# EAGLE design goodfet42 (EAGLE 6.5.0)
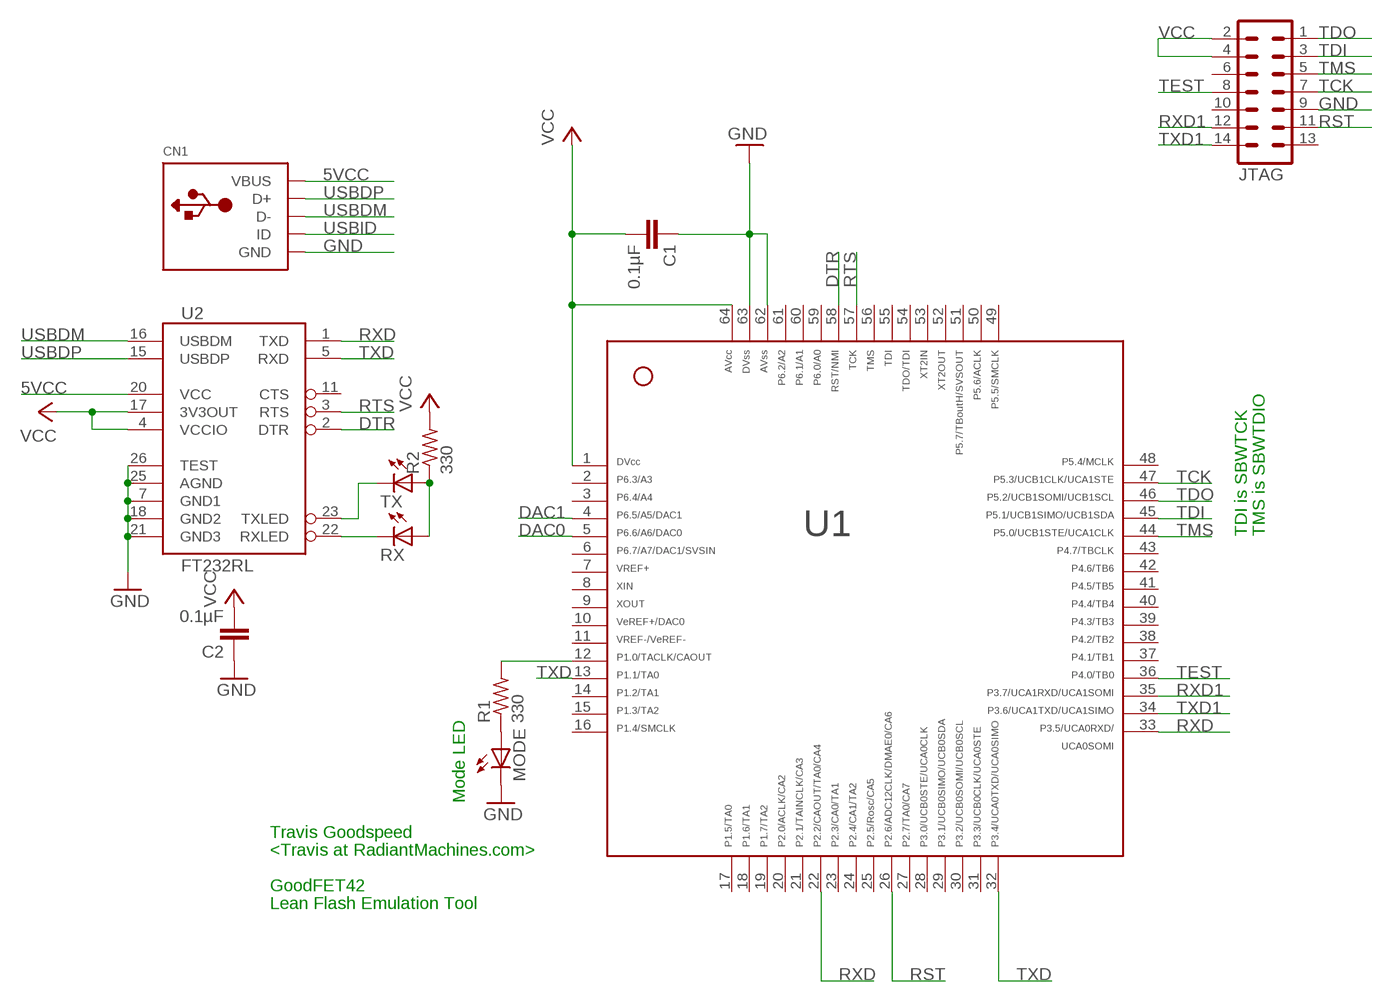
[diagram p0: schematic, sheet 1]

## Parts
C1  0.1µF  C-EUC0603  [C0603]
C2  0.1µF  C-EUC0603  [C0603]
CN1  USBMINIB  [USB-MINIB]
JTAG  MA07-2  [MA07-2]
MODE  LEDCHIP-LED0603  [CHIP-LED0603]
R1  330  R-US_R0603  [R0603]
R2  330  R-US_R0603  [R0603]
RX  LEDCHIP-LED0603  [CHIP-LED0603]
TX  LEDCHIP-LED0603  [CHIP-LED0603]
U1  MSP430F2618TPM  F261X---PM64  [PM/PAG64]
U2  FT232RL  FT232RL-BASICSSOP  [SSOP28DB]

## Nets
5VCC: CN1.VBUS U2.20(VCC)
DAC0: U1.5
DAC1: U1.4
DTR: U1.58 U2.2(DTR)
GND: C1.1 C2.1 CN1.GND JTAG.9 MODE.C U1.62 U1.63 U2.7(GND1) U2.18(GND2) U2.21(GND3) U2.25(AGND) U2.26(TEST)
N$1: R1.2 U1.12
N$2: MODE.A R1.1
N$6: RX.C U2.22(RXLED)
N$7: TX.C U2.23(TXLED)
N$8: R2.1 RX.A TX.A
RST: JTAG.11 U1.26
RTS: U1.57 U2.3(RTS)
RXD: U1.22 U1.33 U2.1(TXD)
RXD1: JTAG.12 U1.35
TCK: JTAG.7 U1.47
TDI: JTAG.3 U1.45
TDO: JTAG.1 U1.46
TEST: JTAG.8 U1.36
TMS: JTAG.5 U1.44
TXD: U1.13 U1.32 U2.5(RXD)
TXD1: JTAG.14 U1.34
USBDM: CN1.D- U2.16(USBDM)
USBDP: CN1.D+ U2.15(USBDP)
USBID: CN1.ID
VCC: C1.2 C2.2 JTAG.2 JTAG.4 R2.2 U1.1 U1.64 U2.4(VCCIO) U2.17(3V3OUT)
Unconnected: JTAG.6 JTAG.10 JTAG.13 U1.2 U1.3 U1.6 U1.7 U1.8 U1.9 U1.10 U1.11 U1.14 U1.15 U1.16 U1.17 U1.18 U1.19 U1.20 U1.21 U1.23 U1.24 U1.25 U1.27 U1.28 U1.29 U1.30 U1.31 U1.37 U1.38 U1.39 U1.40 U1.41 U1.42 U1.43 U1.48 U1.49 U1.50 U1.51 U1.52 U1.53 U1.54 U1.55 U1.56 U1.59 U1.60 U1.61 U2.11(CTS)

## Notes on the sheet
- TDI is SBWTCK | TMS is SBWTDIO
- Mode LED
- Travis Goodspeed
- <Travis at RadiantMachines.com>
- GoodFET42
- Lean Flash Emulation Tool

## Library data of the parts
C1 C2 = rcl:C-EU: CAPACITOR, European symbol
CN1 = adafruit:USB: USB Connectors USBMINIB - Surface Mount Female Mini-B USB Connector 4UConnector: 06564 By microbuilder.eu Thru-hole RA Female Mini-B USB Connector 4UConnector: 18732 By ladyada.net
JTAG = con-lstb:MA07-2: PIN HEADER
MODE RX TX = led:LED: LED OSRAM: - CHIPLED LG R971, LG N971, LY N971, LG Q971, LY Q971, LO R971, LY R971 LH N974, LH R974 LS Q976, LO Q976, LY Q976 LO Q996 - Hyper CHIPLED LW Q18S LB Q993, LB Q99A, LB R99A - SideLED LS A670, LO A670, LY A670, LG A670, LP A670 LB A673, LV A673, LT A673, LW A673 LH A674 LY A675 LS A676, LA A676, LO A676, LY A676, LW A676 LS A679, LY A679, LG A679 - Hyper Micro SIDELED® LS Y876, LA Y876, LO Y876, LY Y876 LT Y87S - SmartLED LW L88C, LW L88S LB L89C, LB L89S, LG L890 LS L89K, LO L89K, LY L89K LS L896, LA L896, LO L896, LY L896 - TOPLED LS T670, LO T670, LY T670, LG T670, LP T670 LSG T670, LSP T670, LSY T670, LOP T670, LYG T670 LG T671, LOG T671, LSG T671 LB T673, LV T673, LT T673, LW T673 LH T674 LS T676, LA T676, LO T676, LY T676, LB T676, LH T676, LSB T676, LW T676 LB T67C, LV T67C, LT T67C, LS T67K, LO T67K, LY T67K, LW E67C LS E67B, LA E67B, LO E67B, LY E67B, LB E67C, LV E67C, LT E67C LW T67C LS T679, LY T679, LG T679 LS T770, LO T770, LY T770, LG T770, LP T770 LB T773, LV T773, LT T773, LW T773 LH T774 LS E675, LA E675, LY E675, LS T675 LS T776, LA T776, LO T776, LY T776, LB T776 LHGB T686 LT T68C, LB T68C - Hyper Mini TOPLED® LB M676 - Mini TOPLED Santana® LG M470 LS M47K, LO M47K, LY M47K Source: http://www.osram.convergy.de LUXEON: - LUMILED® LXK2-PW12-R00, LXK2-PW12-S00, LXK2-PW14-U00, LXK2-PW14-V00 LXK2-PM12-R00, LXK2-PM12-S00, LXK2-PM14-U00 LXK2-PE12-Q00, LXK2-PE12-R00, LXK2-PE12-S00, LXK2-PE14-T00, LXK2-PE14-U00 LXK2-PB12-K00, LXK2-PB12-L00, LXK2-PB12-M00, LXK2-PB14-N00, LXK2-PB14-P00, LXK2-PB14-Q00 LXK2-PR12-L00, LXK2-PR12-M00, LXK2-PR14-Q00, LXK2-PR14-R00 LXK2-PD12-Q00, LXK2-PD12-R00, LXK2-PD12-S00 LXK2-PH12-R00, LXK2-PH12-S00 LXK2-PL12-P00, LXK2-PL12-Q00, LXK2-PL12-R00 Source: www.luxeon.com KINGBRIGHT: KA-3528ASYC Source: www.kingbright.com
R1 R2 = rcl:R-US_: RESISTOR, American symbol
U1 = TI_MSP430_v13:F261X---PM64: ***MSP430F261x***PM64
U2 = SparkFun:FT232RL-BASIC: USB UART This is the simplified version of the FT232RL unit. Only what you need, nothing you don't. Spark Fun Electronics SKU : COM-00650

## Board
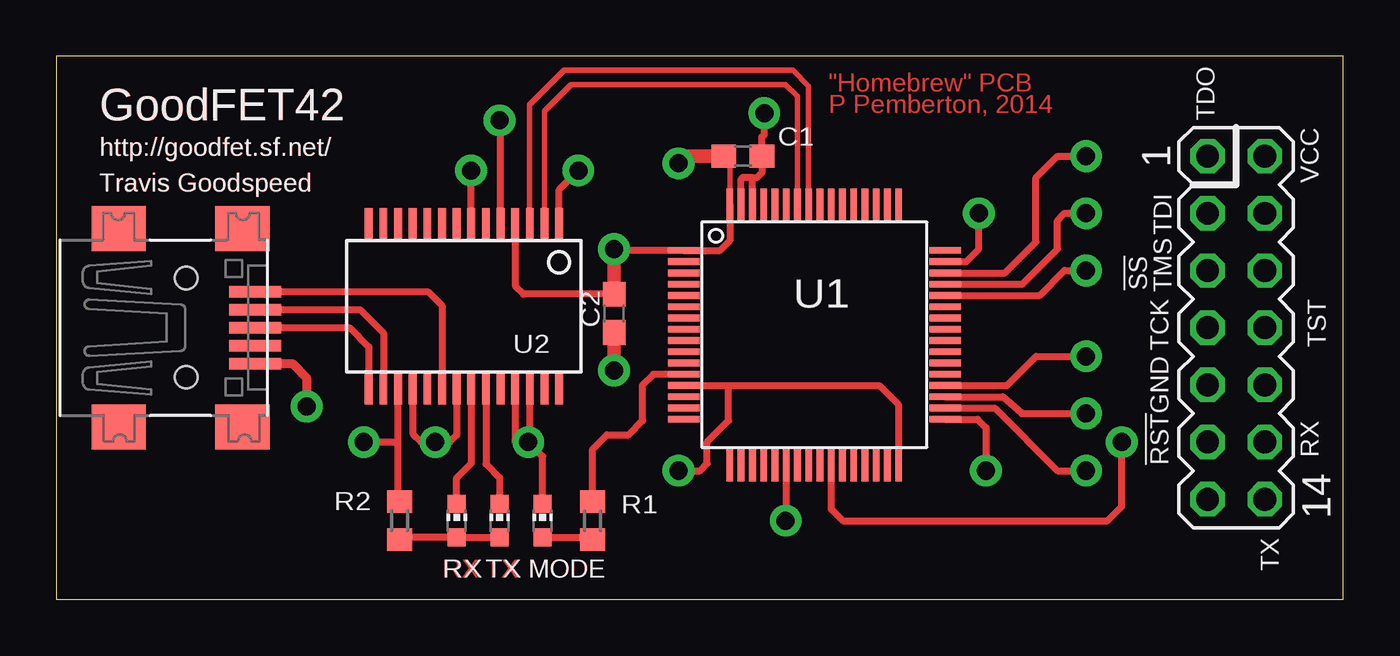
[diagram p1: board, top side]
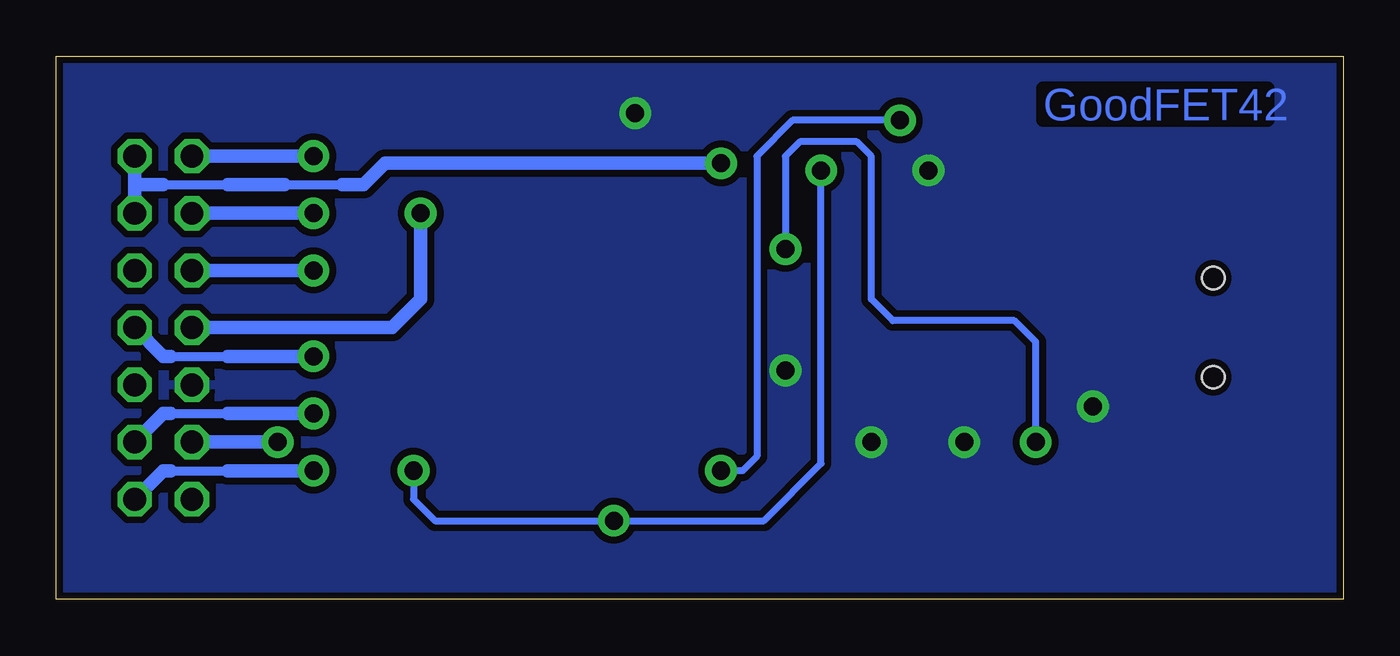
[diagram p2: board, bottom side, seen from below]

Size 57.14 x 24.12 mm. Coordinates in mm from the lower left corner, seen from the top.
Outline: 0,0 57.14,0 57.14,24.12 0,24.12 0,0
Copper layers (1*16): Top 0.035mm / dielectric 1.5mm / Bottom 0.035mm
Design rules "default *": minimum track width 10mil, minimum drill 8mil, track to track 6mil, track to pad 6mil, pad to pad 6mil, via to via 6mil, smd to smd 6mil, copper to edge 10mil, drill to drill 8mil, minimum pad ring 10mil, minimum via ring 12mil, stop-mask expansion 4mil, vias tented up to drill 25mil, thermal gap 10mil

### Footprints (pad centres in the part's own frame; a part is rotated, then mirrored left to right if it is on the bottom)
C0603 = smd 1.1 x 1: 1 -0.85,0; 2 0.85,0
USB-MINIB = smd 0.5 x 2.308: D+ 0,4.064; D- -0.8,4.064; GND 1.6,4.064; ID 0.8,4.064; VBUS -1.6,4.064 | smd 2 x 2.4: GND1 -4.4,-2; GND2 -4.4,3.5; GND3 4.4,3.5; GND4 4.4,-2 | hole 1: -2.2,1; 2.2,1
MA07-2 = drill 1.016 octagon: 1 -7.62,-1.27; 2 -7.62,1.27; 3 -5.08,-1.27; 4 -5.08,1.27; 5 -2.54,-1.27; 6 -2.54,1.27; 7 0,-1.27; 8 0,1.27; 9 2.54,-1.27; 10 2.54,1.27; 11 5.08,-1.27; 12 5.08,1.27; 13 7.62,-1.27; 14 7.62,1.27
CHIP-LED0603 = smd 0.8 x 0.8: A 0,-0.75; C 0,0.75
R0603 = smd 1 x 1.1: 1 -0.85,0; 2 0.85,0
PM/PAG64 = smd 1.4 x 0.3: 1 -5.8,3.75; 2 -5.8,3.25; 3 -5.8,2.75; 4 -5.8,2.25; 5 -5.8,1.75; 6 -5.8,1.25; 7 -5.8,0.75; 8 -5.8,0.25; 9 -5.8,-0.25; 10 -5.8,-0.75; 11 -5.8,-1.25; 12 -5.8,-1.75; 13 -5.8,-2.25; 14 -5.8,-2.75; 15 -5.8,-3.25; 16 -5.8,-3.75; 33 5.8,-3.75; 34 5.8,-3.25; 35 5.8,-2.75; 36 5.8,-2.25; 37 5.8,-1.75; 38 5.8,-1.25; 39 5.8,-0.75; 40 5.8,-0.25; 41 5.8,0.25; 42 5.8,0.75; 43 5.8,1.25; 44 5.8,1.75; 45 5.8,2.25; 46 5.8,2.75; 47 5.8,3.25; 48 5.8,3.75 | smd 0.3 x 1.4: 17 -3.75,-5.8; 18 -3.25,-5.8; 19 -2.75,-5.8; 20 -2.25,-5.8; 21 -1.75,-5.8; 22 -1.25,-5.8; 23 -0.75,-5.8; 24 -0.25,-5.8; 25 0.25,-5.8; 26 0.75,-5.8; 27 1.25,-5.8; 28 1.75,-5.8; 29 2.25,-5.8; 30 2.75,-5.8; 31 3.25,-5.8; 32 3.75,-5.8; 49 3.75,5.8; 50 3.25,5.8; 51 2.75,5.8; 52 2.25,5.8; 53 1.75,5.8; 54 1.25,5.8; 55 0.75,5.8; 56 0.25,5.8; 57 -0.25,5.8; 58 -0.75,5.8; 59 -1.25,5.8; 60 -1.75,5.8; 61 -2.25,5.8; 62 -2.75,5.8; 63 -3.25,5.8; 64 -3.75,5.8
SSOP28DB = smd 0.348 x 1.397: 1 -4.225,-3.656; 2 -3.575,-3.656; 3 -2.925,-3.656; 4 -2.275,-3.656; 5 -1.625,-3.656; 6 -0.975,-3.656; 7 -0.325,-3.656; 8 0.325,-3.656; 9 0.975,-3.656; 10 1.625,-3.656; 11 2.275,-3.656; 12 2.925,-3.656; 13 3.575,-3.656; 14 4.225,-3.656; 15 4.225,3.656; 16 3.575,3.656; 17 2.925,3.656; 18 2.275,3.656; 19 1.625,3.656; 20 0.975,3.656; 21 0.325,3.656; 22 -0.325,3.656; 23 -0.975,3.656; 24 -1.625,3.656; 25 -2.275,3.656; 26 -2.925,3.656; 27 -3.575,3.656; 28 -4.225,3.656

### Placement (x,y rotation side)
C1  30.48,19.68 180 top
C2  24.77,12.7 90 top
CN1  4.76,12.06 270 top
JTAG  52.39,12.06 270 top
MODE  21.59,3.49 0 top
R1  23.81,3.49 90 top
R2  15.24,3.49 90 top
RX  17.78,3.49 0 top
TX  19.68,3.49 0 top
U1  33.66,11.75 0 top
U2  18.1,13.02 180 top

### Tracks (layer width: path | path; a pad name or v marks a point on that pad's centre or on a via)
5VCC
  Top 0.305: U2.20 17.12,13.04 16.5,13.66 CN1.VBUS
DTR
  Top 0.254: U2.2 21.67,21.67 22.86,22.86 32.38,22.86 32.91,22.34 U1.58
GND  (via drill 0.8)
  Top 0.254: 24.87,11.75 C2.1 | U2.7 18.42,16.52 18.41,16.51
  Top 0.305: U2.18 15.82,7.36 16.19,6.99 v16.83,6.99 17.46,6.99 17.77,7.29 U2.21 | 18.41,16.51 v18.41,19.05 | U1.63 30.41,18.66 30.48,18.73 30.91,18.73 | 30.91,18.73 31.11,18.73 31.33,18.95 C1.1 31.33,20.54 31.43,20.64 v31.43,21.59 | U1.62 30.91,18.73 | MODE.C 21.59,6.35 v20.95,6.99 | U2.25 20.37,6.99 v20.95,6.99 | U2.26 21.02,6.99 v20.95,6.99
  Top 0.406: CN1.GND 10.49,10.46 11.11,9.84 v11.11,8.57
  Top 0.61: v24.77,10.16 C2.1
  pour Bottom (isolate 0.305): 0.32,0.32 56.83,0.32 56.83,23.81 0.32,23.81
N$1
  Top 0.305: R1.2 23.81,6.67 24.45,7.3 25.4,7.3 26.04,7.94 26.04,9.53 26.51,10 U1.12
N$2
  Top 0.305: MODE.A 23.71,2.74 R1.1
N$6
  Top 0.305: RX.C 17.78,5.4 18.42,6.04 U2.22
N$7
  Top 0.305: U2.23 19.07,6.01 19.68,5.4 TX.C
N$8
  Top 0.305: R2.1 15.34,2.74 RX.A TX.A
RST  (via drill 0.8)
  Top 0.305: U1.26 34.41,4.01 34.92,3.49 46.67,3.49 47.31,4.13 v47.31,6.99
  Bottom 0.61: JTAG.11 v47.31,6.99
RTS
  Top 0.254: U2.3 21.02,21.98 22.54,23.5 32.7,23.5 33.41,22.79 U1.57
RXD  (via drill 0.8)
  Top 0.305: U1.22 32.41,3.51 v32.38,3.49 | U2.1 22.32,18.2 v23.18,19.05 | U1.33 40.9,8 41.27,7.62 v41.27,5.71
  Bottom 0.305: v23.18,19.05 23.18,6.03 25.72,3.49 v32.38,3.49 40.32,3.49 41.27,4.45 v41.27,5.71
RXD1  (via drill 0.8)
  Top 0.305: U1.35 42.02,9 42.86,8.26 v45.72,8.26
  Bottom 0.406: 52.07,8.26 49.53,8.26
  Bottom 0.61: JTAG.12 52.39,8.26 52.07,8.26 | 49.53,8.26 v45.72,8.26
TCK  (via drill 0.8)
  Top 0.305: U1.47 40.4,15 40.96,15.56 v40.96,17.14
  Bottom 0.61: JTAG.7 42.23,12.06 40.96,13.34 v40.96,17.14
TDI  (via drill 0.8)
  Top 0.305: U1.45 42.89,14 44.45,15.56 44.45,16.83 44.77,17.14 v45.72,17.14
  Bottom 0.61: JTAG.3 v45.72,17.14
TDO  (via drill 0.8)
  Top 0.305: U1.46 42.12,14.5 43.5,15.88 43.5,18.73 44.45,19.68 v45.72,19.68
  Bottom 0.61: JTAG.1 v45.72,19.68
TEST  (via drill 0.8)
  Top 0.305: U1.36 42.2,9.5 43.5,10.79 v45.72,10.79
  Bottom 0.406: 52.07,10.79 49.53,10.79
  Bottom 0.61: JTAG.8 52.39,10.79 52.07,10.79 | 49.53,10.79 v45.72,10.79
TMS  (via drill 0.8)
  Top 0.305: U1.44 43.66,13.5 44.77,14.61 v45.72,14.61
  Bottom 0.61: JTAG.5 v45.72,14.61
TXD  (via drill 0.8)
  Top 0.305: U1.32 37.41,8.63 36.54,9.5 29.84,9.5 | U1.13 29.84,9.5 | U2.5 19.72,21.23 v19.68,21.27 | v27.62,5.71 28.57,5.71 28.89,6.03 28.89,6.99 29.84,7.94 29.84,9.5
  Bottom 0.305: v19.68,21.27 24.45,21.27 26.04,19.68 26.04,6.35 26.67,5.71 v27.62,5.71
TXD1  (via drill 0.8)
  Top 0.305: U1.34 41.67,8.5 44.45,5.71 v45.72,5.71
  Bottom 0.406: 52.07,5.71 49.53,5.71
  Bottom 0.61: JTAG.14 52.39,5.71 52.07,5.71 | 49.53,5.71 v45.72,5.71
USBDM
  Top 0.305: U2.16 14.52,11.83 13.49,12.87 CN1.D-
USBDP
  Top 0.305: U2.15 13.87,11.21 13.02,12.06 CN1.D+
VCC  (via drill 0.8)
  Top 0.254: R2.2 15.17,4.73 | U1.64 29.91,19.41 C1.2
  Top 0.305: U1.64 29.91,15.94 29.47,15.5 U1.1 24.82,15.5 v24.77,15.56 | U2.4 20.37,13.92 20.74,13.55 C2.2 | v13.65,6.99 15.17,6.99 | 15.17,4.73 15.17,6.99 | 15.17,6.99 U2.17
  Top 0.61: C1.2 27.94,19.68 v27.62,19.37 | C2.2 v24.77,15.56
  Bottom 0.305: v13.65,6.99 13.65,11.43 14.61,12.38 20,12.38 20.95,13.34 20.95,19.68 21.59,20.32 24.13,20.32 24.77,19.68 v24.77,15.56
  Bottom 0.406: 52.39,18.41 49.53,18.41 | 46.99,18.41 44.45,18.41
  Bottom 0.61: 53.66,18.41 JTAG.2 | JTAG.4 53.66,18.41 | 53.66,18.41 52.39,18.41 | 49.53,18.41 46.99,18.41 | 44.45,18.41 43.5,18.41 42.55,19.37 v27.62,19.37

### Text on the board
Top: "Homebrew" PCB | P Pemberton, 2014 | GoodFET42 | http://goodfet.sf.net/ | Travis Goodspeed | RX | TX | MODE
Bottom: GoodFET42
tNames: GoodFET42 | TDO | VCC | http://goodfet.sf.net/ | Travis Goodspeed | TDI | !SS | TMS | TCK | TST | GND | !RST | RX | TX